# EAGLE schematic TINRS - Wobbler (pico)sch (EAGLE 7.7.0)

## Sheet 1 of 5: MCU & Eeprom
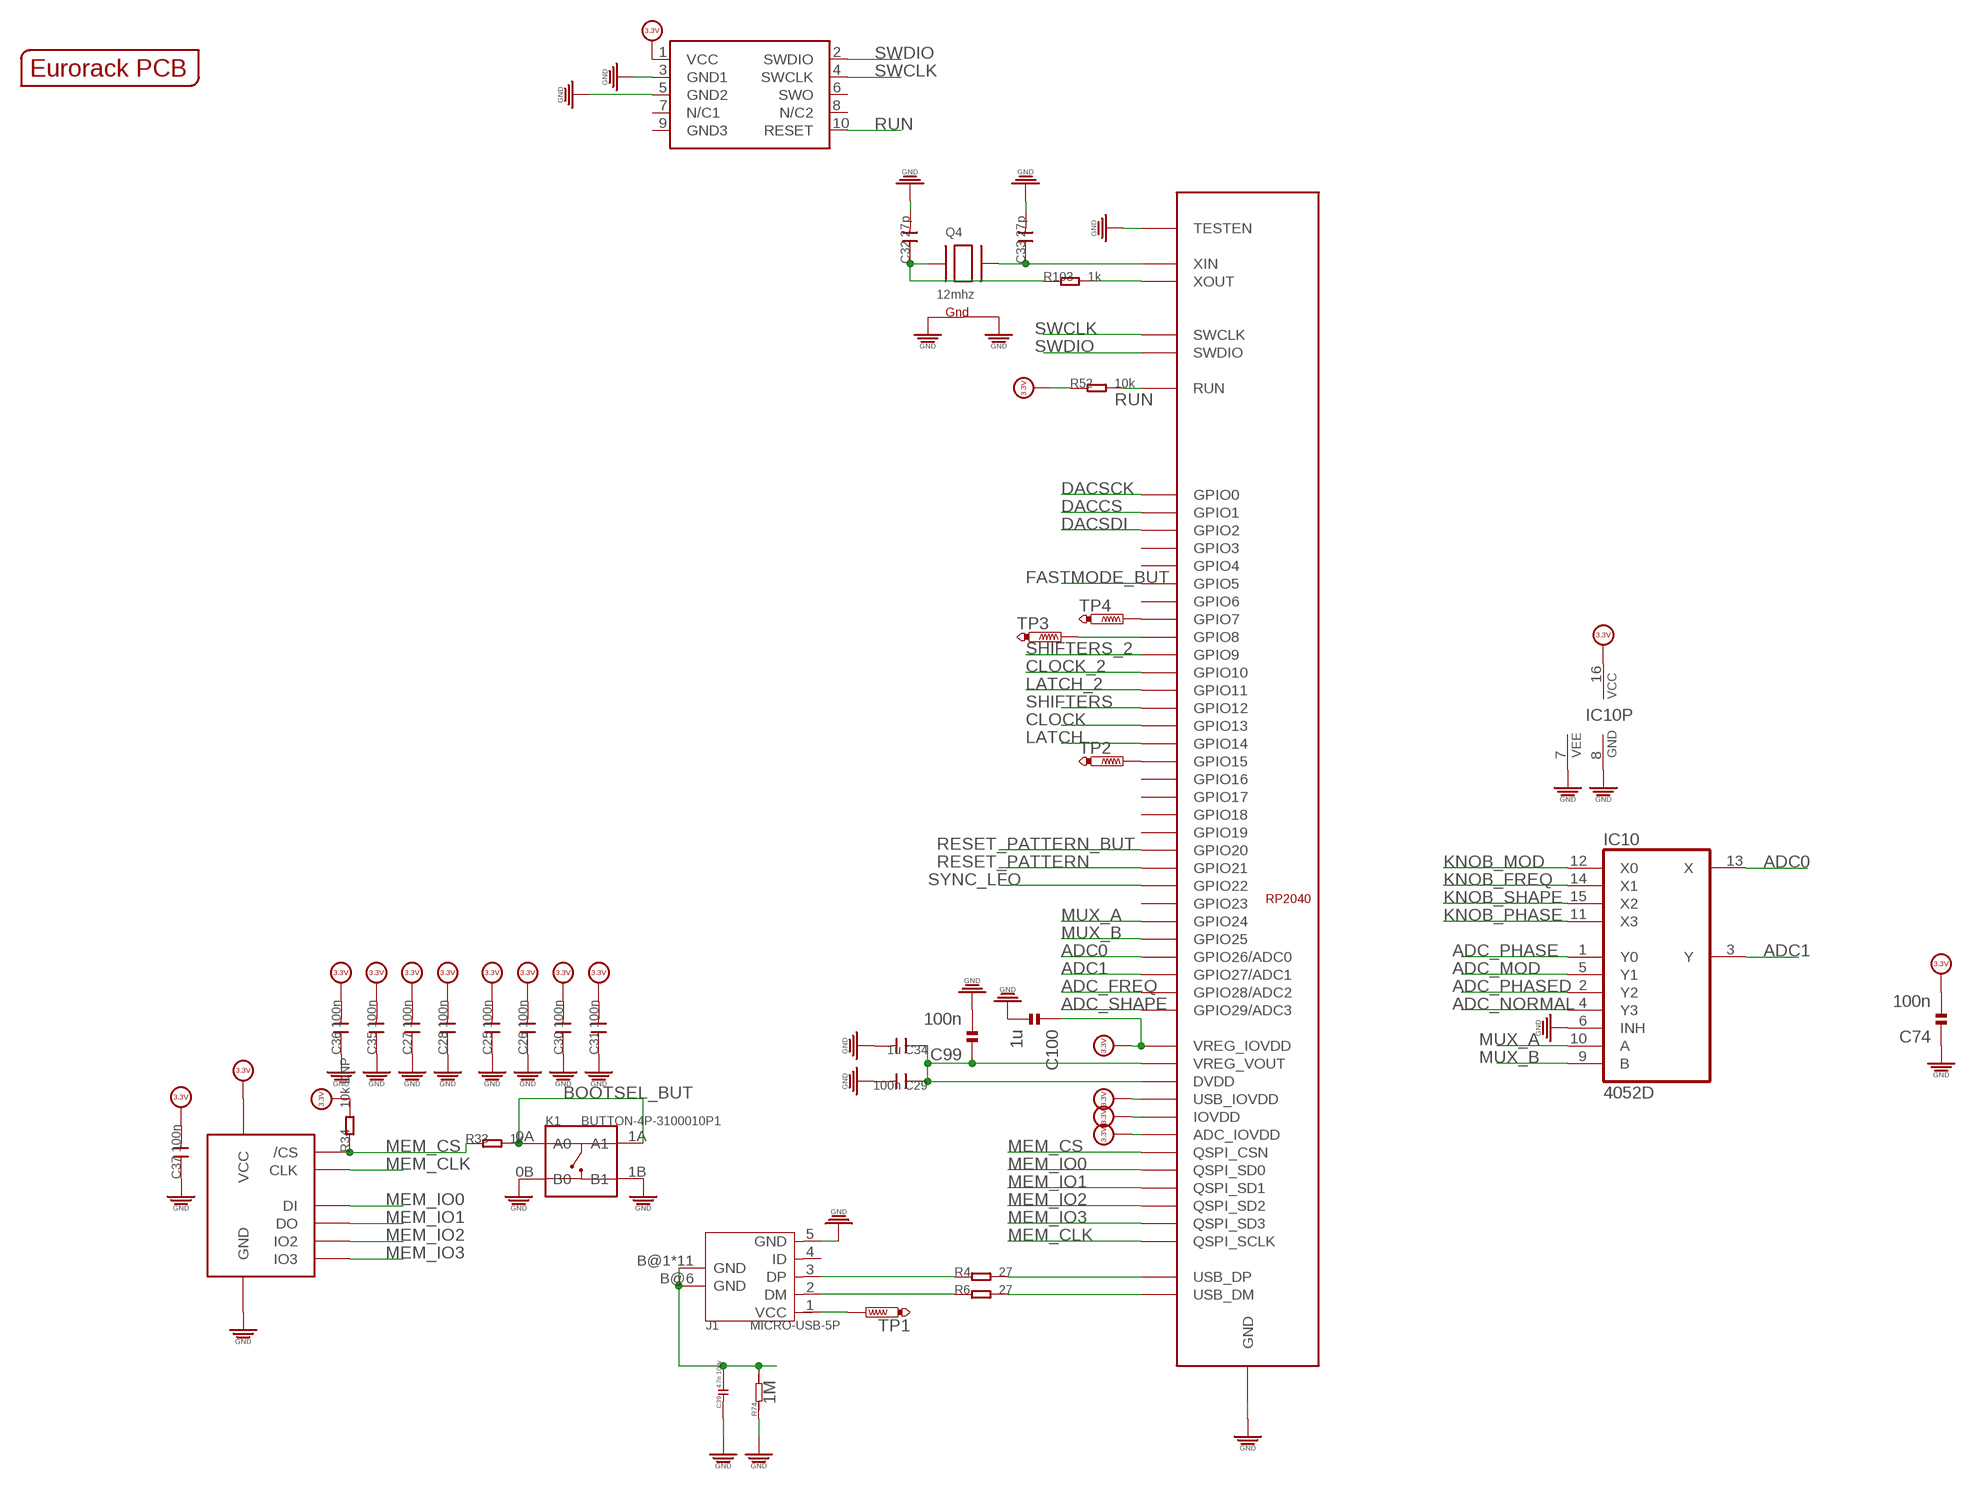
[diagram p0: schematic, sheet 1]

### Parts
C25  100n  C-0402  [C0402]
C26  100n  C-0402  [C0402]
C27  100n  C-0402  [C0402]
C28  100n  C-0402  [C0402]
C29  100n  C-0402  [C0402]
C30  100n  C-0402  [C0402]
C31  100n  C-0402  [C0402]
C32  27p  C-0402  [C0402]
C33  27p  C-0402  [C0402]
C34  1u  C-0402  [C0402]
C35  100n  C-0402  [C0402]
C36  100n  C-0402  [C0402]
C37  100n  C-0402  [C0402]
C39  4.7n 100v  C-1206  [C3216]
C74  100n  C-EUC0402  [C0402]
C99  100n  C-EUC0402  [C0402]
C100  1u  C-EUC0402  [C0402]
IC10  4052D  [SO16]
J1  MICRO-USB-5P  [C132563]
K1  BUTTON-4P-3100010P1  [4P-SMD-6.0X6.0X5.0H]
OUTLINE  EURORACK_PCB12HP  [EURORACK12HPPCB]
Q4  12mhz  XTAL-4-3225  [NX3225]
R4  27  R-0402  [R0402]
R6  27  R-0402  [R0402]
R33  1k  R-0402  [R0402]
R34  10k DNP  R-0402  [R0402]
R52  10k  R-0402  [R0402]
R74  1M  R-0603  [R0603]
R103  1k  R-0402  [R0402]
SWD2  CORTEX_SWD  [M50-3600542]
TP1  PTR1B1,27  [B1,27]
TP2  PTR1B1,27  [B1,27]
TP3  PTR1B1,27  [B1,27]
TP4  PTR1B1,27  [B1,27]
U$2  RP2040  [QFN-56]
U$25  W25Q256JVEIQTR  W25Q128JVSIQ  [SOIC-8]

### Nets
1.1V: C29.1 C34.1 C99.1 U$2.P$23(DVDD) U$2.P$45(VREG_VOUT) U$2.P$50(DVDD)
3.3V: C25.2 C26.2 C27.2 C28.2 C30.2 C31.2 C35.2 C36.2 C37.2 C74.2 C100.1 IC10.16(VCC) R34.2 R52.1 SWD2.1(VCC) U$2.P$1(IOVDD) U$2.P$10(IOVDD) U$2.P$22(IOVDD) U$2.P$33(IOVDD) U$2.P$42(IOVDD) U$2.P$43(ADC_IOVDD) U$2.P$44(VREG_IOVDD) U$2.P$48(USB_IOVDD) U$2.P$49(IOVDD) U$25.8(VCC) ; also sheet 2,3,4,5
ADC0: IC10.13(X) U$2.P$38(GPIO26/ADC0)
ADC1: IC10.3(Y) U$2.P$39(GPIO27/ADC1)
ADC_FREQ: U$2.P$40(GPIO28/ADC2) ; also sheet 5
ADC_MOD: IC10.5(Y1) ; also sheet 5
ADC_NORMAL: IC10.4(Y3) ; also sheet 5
ADC_PHASE: IC10.1(Y0) ; also sheet 5
ADC_PHASED: IC10.2(Y2) ; also sheet 5
ADC_SHAPE: U$2.P$41(GPIO29/ADC3) ; also sheet 5
BOOTSEL_BUT: K1.0A(A0) K1.1A(A1) R33.2
CLOCK: U$2.P$16(GPIO13) ; also sheet 2
CLOCK_2: U$2.P$13(GPIO10) ; also sheet 2
DACCS: U$2.P$3(GPIO1) ; also sheet 3
DACSCK: U$2.P$2(GPIO0) ; also sheet 3
DACSDI: U$2.P$4(GPIO2) ; also sheet 3
FASTMODE_BUT: U$2.P$7(GPIO5) ; also sheet 2
GND: C25.1 C26.1 C27.1 C28.1 C29.2 C30.1 C31.1 C32.2 C33.2 C34.2 C35.1 C36.1 C37.1 C39.P$1 C74.1 C99.2 C100.2 IC10.6(INH) IC10.7(VEE) IC10.8(GND) J1.5(GND) K1.0B(B0) K1.1B(B1) Q4.2(G2) Q4.4(G1) R74.1 SWD2.3(GND1) SWD2.5(GND2) U$2.GND U$2.P$19(TESTEN) U$25.4(GND) ; also sheet 2,3,4,5
KNOB_FREQ: IC10.14(X1) ; also sheet 5
KNOB_MOD: IC10.12(X0) ; also sheet 5
KNOB_PHASE: IC10.11(X3) ; also sheet 5
KNOB_SHAPE: IC10.15(X2) ; also sheet 5
LATCH: U$2.P$17(GPIO14) ; also sheet 2
LATCH_2: U$2.P$14(GPIO11) ; also sheet 2
MEM_CLK: U$2.P$52(QSPI_SCLK) U$25.6(CLK)
MEM_CS: R33.1 R34.1 U$2.P$56(QSPI_CSN) U$25.1(/CS)
MEM_IO0: U$2.P$53(QSPI_SD0) U$25.5(DI)
MEM_IO1: U$2.P$55(QSPI_SD1) U$25.2(DO)
MEM_IO2: U$2.P$54(QSPI_SD2) U$25.3(IO2)
MEM_IO3: U$2.P$51(QSPI_SD3) U$25.7(IO3)
MUX_A: IC10.10(A) U$2.P$36(GPIO24)
MUX_B: IC10.9(B) U$2.P$37(GPIO25)
N$2: C33.1 Q4.3(X2) U$2.P$20(XIN)
N$17: C32.1 Q4.1(X1) R103.1
N$18: R4.2 U$2.P$47(USB_DP)
N$24: R6.2 U$2.P$46(USB_DM)
N$69: C39.P$2 J1.B@1(GND) J1.B@2(GND) J1.B@3(GND) J1.B@4(GND) J1.B@5(GND) J1.B@6(GND) J1.B@7(GND) J1.B@8(GND) J1.B@9(GND) J1.B@10(GND) J1.B@11(GND) J1.B@12(GND) R74.2
N$81: J1.1(VCC) TP1.TP
N$82: TP2.TP U$2.P$18(GPIO15)
N$86: TP4.TP U$2.P$9(GPIO7)
N$87: R103.2 U$2.P$21(XOUT)
N$100: TP3.TP U$2.P$11(GPIO8)
RESET_PATTERN: U$2.P$32(GPIO21) ; also sheet 5
RESET_PATTERN_BUT: U$2.P$31(GPIO20) ; also sheet 2
RUN: R52.2 SWD2.10(RESET) U$2.P$26(RUN)
SHIFTERS: U$2.P$15(GPIO12) ; also sheet 2
SHIFTERS_2: U$2.P$12(GPIO9) ; also sheet 2
SWCLK: SWD2.4(SWCLK) U$2.P$24(SWCLK)
SWDIO: SWD2.2(SWDIO) U$2.P$25(SWDIO)
SYNC_LFO: U$2.P$34(GPIO22) ; also sheet 5
USB_N [groundplane]: J1.2(DM) R6.1
USB_P [groundplane]: J1.3(DP) R4.1
Unconnected: J1.4(ID) SWD2.6(SWO) SWD2.7(N/C1) SWD2.8(N/C2) SWD2.9(GND3) U$2.P$5(GPIO3) U$2.P$6(GPIO4) U$2.P$8(GPIO6) U$2.P$27(GPIO16) U$2.P$28(GPIO17) U$2.P$29(GPIO18) U$2.P$30(GPIO19) U$2.P$35(GPIO23)

## Sheet 2 of 5: LEDs & button
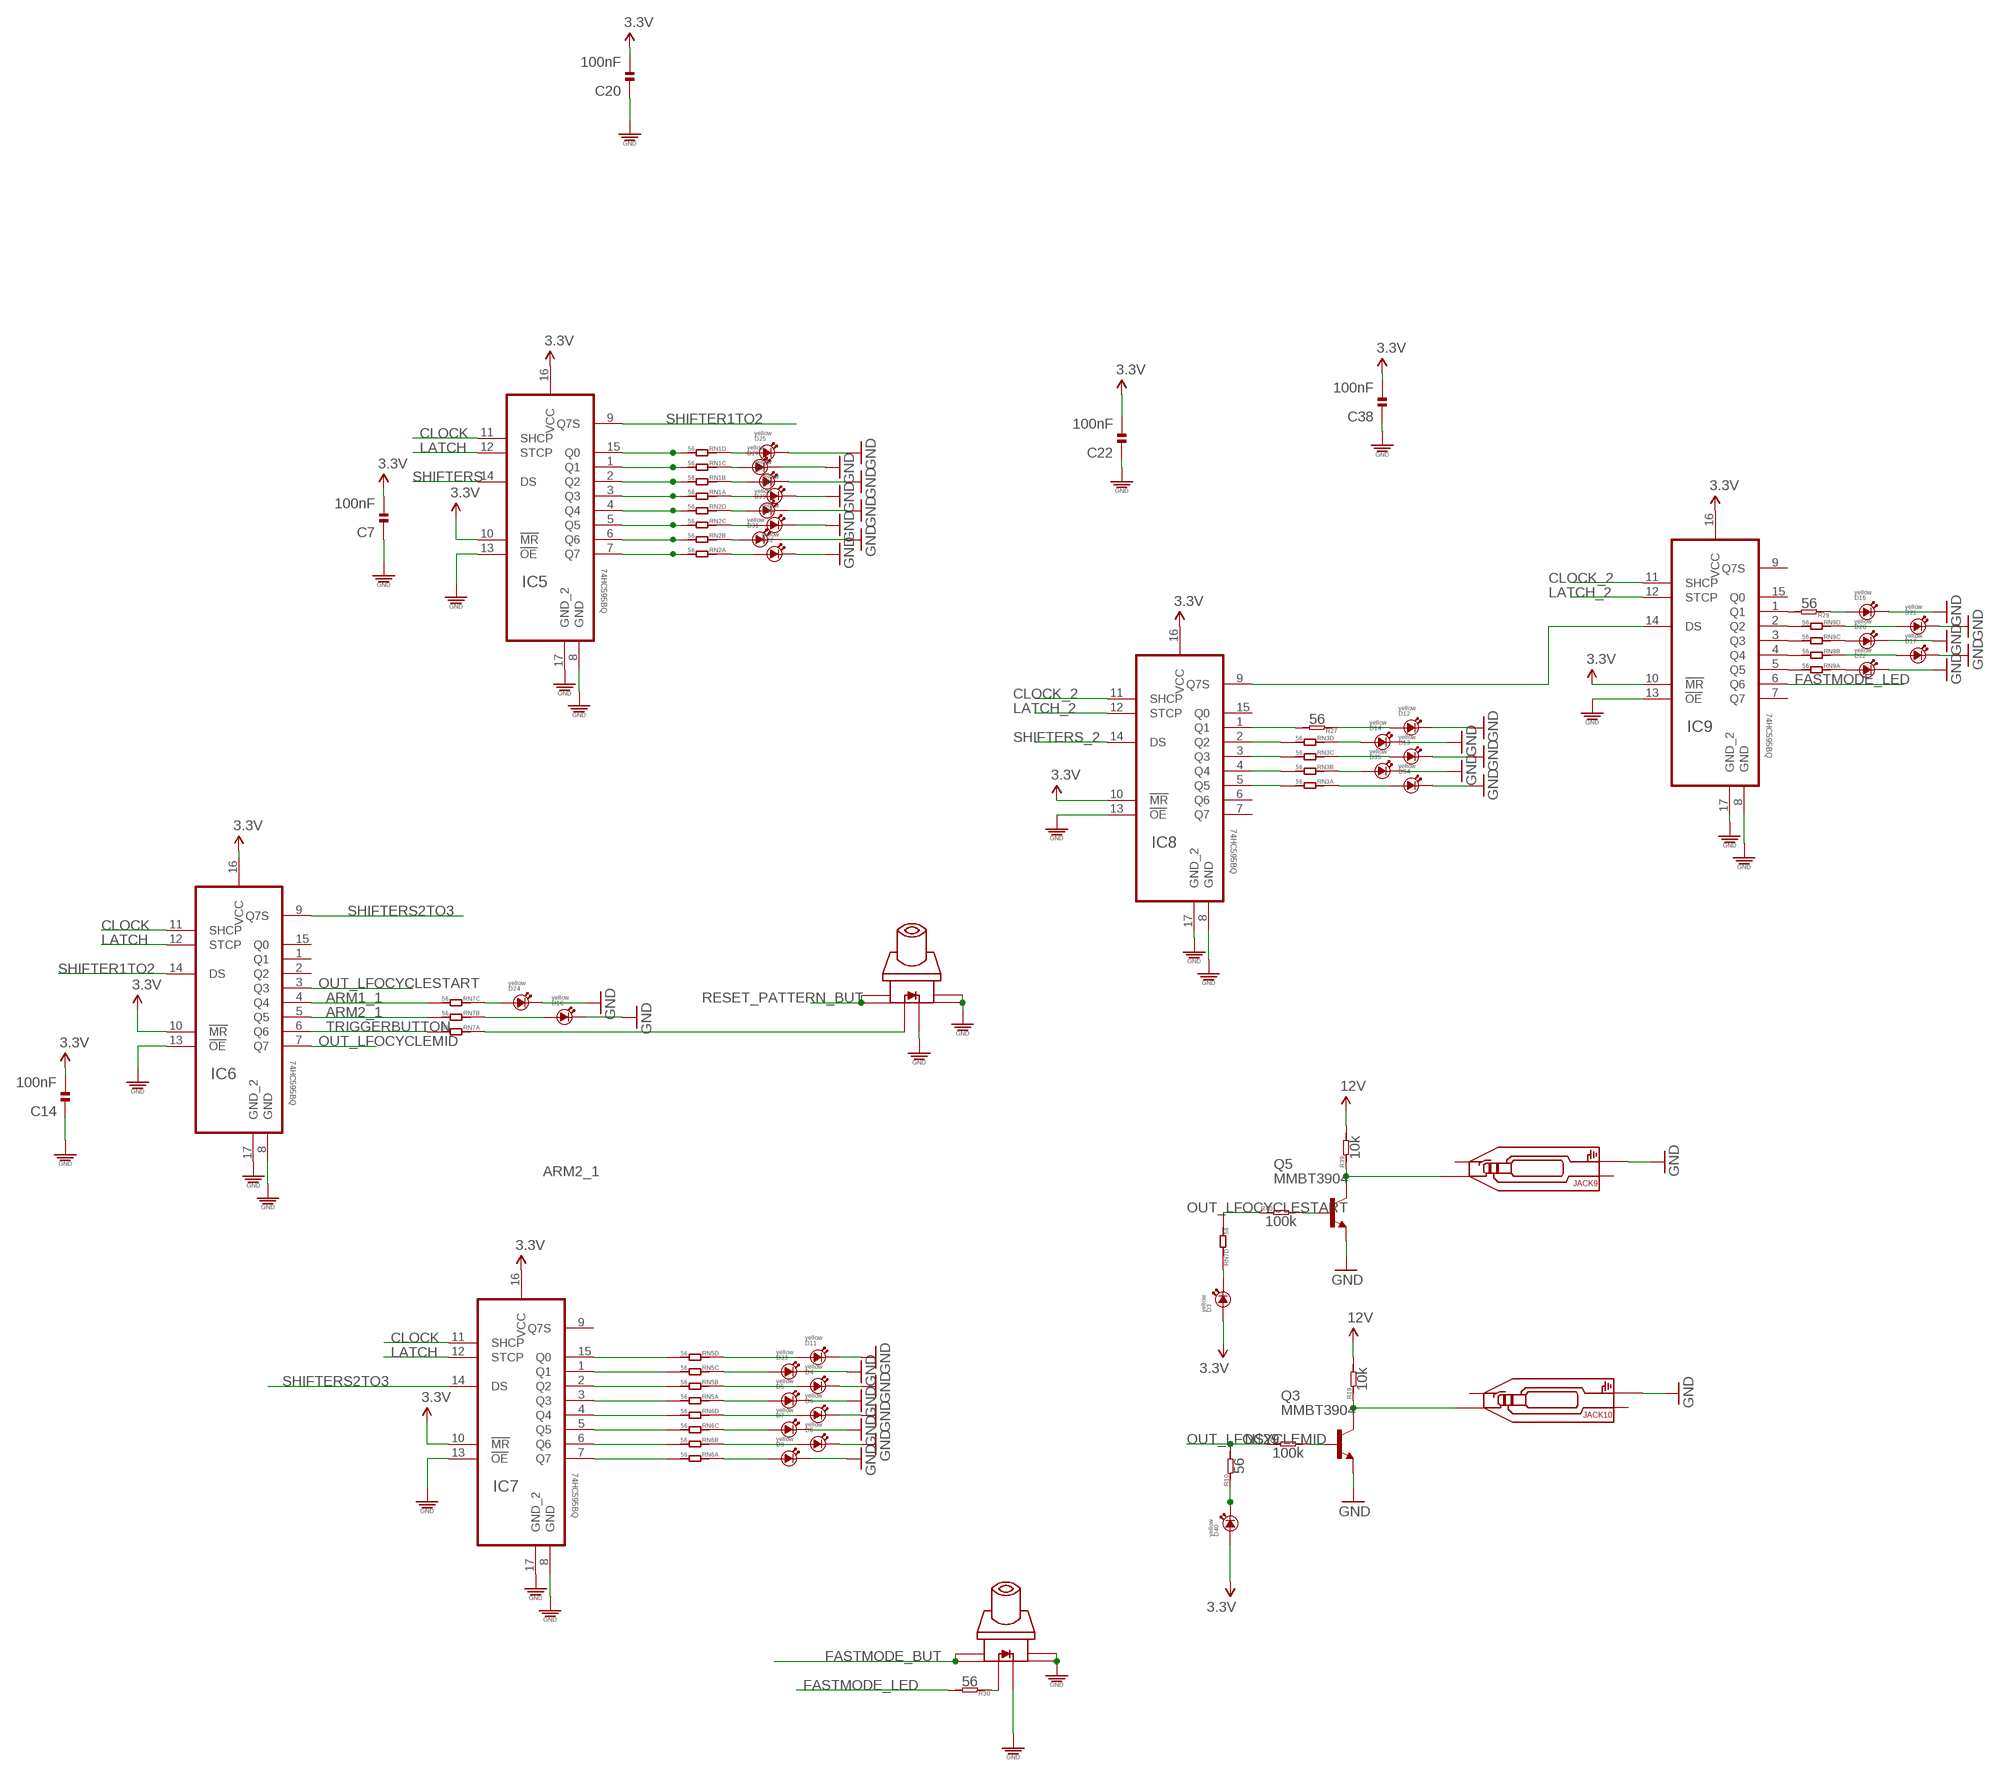
[diagram p1: schematic, sheet 2]

### Parts
C7  100nF  C-EUC0402  [C0402]
C14  100nF  C-EUC0402  [C0402]
C20  100nF  C-EUC0402  [C0402]
C22  100nF  C-EUC0402  [C0402]
C38  100nF  C-EUC0402  [C0402]
D3  yellow  LED3MM  [3MMLED]
D4  yellow  LED3MM  [3MMLED]
D5  yellow  LED3MM  [3MMLED]
D6  yellow  LED3MM  [3MMLED]
D7  yellow  LED3MM  [3MMLED]
D8  yellow  LED3MM  [3MMLED]
D9  yellow  LED3MM  [3MMLED]
D10  yellow  LED3MM  [3MMLED]
D11  yellow  LED3MM  [3MMLED]
D12  yellow  LED3MM  [3MMLED]
D13  yellow  LED3MM  [3MMLED]
D14  yellow  LED3MM  [3MMLED]
D16  yellow  LED3MM  [3MMLED]
D17  yellow  LED3MM  [3MMLED]
D20  yellow  LED3MM  [3MMLED]
D21  yellow  LED3MM  [3MMLED]
D22  yellow  LED3MM  [3MMLED]
D24  yellow  LED3MM  [3MMLED]
D25  yellow  LED3MM  [3MMLED]
D26  yellow  LED3MM  [3MMLED]
D27  yellow  LED3MM  [3MMLED]
D28  yellow  LED3MM  [3MMLED]
D29  yellow  LED3MM  [3MMLED]
D30  yellow  LED3MM  [3MMLED]
D31  yellow  LED3MM  [3MMLED]
D32  yellow  LED3MM  [3MMLED]
D33  yellow  LED3MM  [3MMLED]
D34  yellow  LED3MM  [3MMLED]
D35  yellow  LED3MM  [3MMLED]
D40  yellow  LED3MM  [3MMLED]
IC5  74HC595BQ  [QFN50P250X350X100-17N]
IC6  74HC595BQ  [QFN50P250X350X100-17N]
IC7  74HC595BQ  [QFN50P250X350X100-17N]
IC8  74HC595BQ  [QFN50P250X350X100-17N]
IC9  74HC595BQ  [QFN50P250X350X100-17N]
JACK9  AUDIO-JACK_SMALLSYMBOL  [3.5MM-JACK-SWITCH-13MM-NOHOLES-TESTPAD]
JACK10  AUDIO-JACK_SMALLSYMBOL  [3.5MM-JACK-SWITCH-13MM-NOHOLES-TESTPAD]
Q3  MMBT3904  MMBT3904LT1-NPN-SOT23-BEC  [SOT23-BEC]
Q5  MMBT3904  MMBT3904LT1-NPN-SOT23-BEC  [SOT23-BEC]
R10  56  R-0603  [R0603]
R19  10k  R-0603  [R0603]
R21  100k  R-0603  [R0603]
R27  56  R-0603  [R0603]
R29  56  R-0603  [R0603]
R30  56  R-0603  [R0603]
R39  10k  R-0603  [R0603]
R40  100k  R-0603  [R0603]
RN1  56  4R-N0402ARV341  [4X0402ARV341]
RN2  56  4R-N0402ARV341  [4X0402ARV341]
RN3  56  4R-N0402ARV341  [4X0402ARV341]
RN5  56  4R-N0402ARV341  [4X0402ARV341]
RN6  56  4R-N0402ARV341  [4X0402ARV341]
RN7  56  4R-N0402ARV341  [4X0402ARV341]
RN9  56  4R-N0402ARV341  [4X0402ARV341]
U$1  SWITCH_W_LED_PB6149L-X-102YELLOW  [PB6149L]
U$28  SWITCH_W_LED_PB6149L-X-102YELLOW  [PB6149L]

### Nets
3.3V: C7.2 C14.2 C20.2 C22.2 C38.2 D3.+ D40.+ IC5.10(!MR) IC5.16(VCC) IC6.10(!MR) IC6.16(VCC) IC7.10(!MR) IC7.16(VCC) IC8.10(!MR) IC8.16(VCC) IC9.10(!MR) IC9.16(VCC) ; also sheet 1,3,4,5
12V [heavypower]: R19.2 R39.2 ; also sheet 3,4
ARM1_1: IC6.4(Q4) RN7.3
ARM2_1: IC6.5(Q5) RN7.2
CLOCK: IC5.11(SHCP) IC6.11(SHCP) IC7.11(SHCP) ; also sheet 1
CLOCK_2: IC8.11(SHCP) IC9.11(SHCP) ; also sheet 1
FASTMODE_BUT: U$28.1 U$28.2 ; also sheet 1
FASTMODE_LED: IC9.6(Q6) R30.2
GND: C7.1 C14.1 C20.1 C22.1 C38.1 D4.- D5.- D6.- D7.- D8.- D9.- D10.- D11.- D12.- D13.- D14.- D16.- D17.- D20.- D21.- D22.- D24.- D25.- D26.- D27.- D28.- D29.- D30.- D31.- D32.- D33.- D34.- D35.- IC5.8(GND) IC5.13(!OE) IC5.17(GND_2) IC6.8(GND) IC6.13(!OE) IC6.17(GND_2) IC7.8(GND) IC7.13(!OE) IC7.17(GND_2) IC8.8(GND) IC8.13(!OE) IC8.17(GND_2) IC9.8(GND) IC9.13(!OE) IC9.17(GND_2) JACK9.RING_B@1(RING) JACK9.RING_T@3(RING) JACK10.RING_B@1(RING) JACK10.RING_T@3(RING) Q3.E Q5.E U$1.3 U$1.4 U$1.LEDNEG(NEG) U$28.3 U$28.4 U$28.LEDNEG(NEG) ; also sheet 1,3,4,5
LATCH: IC5.12(STCP) IC6.12(STCP) IC7.12(STCP) ; also sheet 1
LATCH_2: IC8.12(STCP) IC9.12(STCP) ; also sheet 1
N$1: IC5.15(Q0) RN1.4
N$14: D7.+ RN6.6
N$19: IC5.1(Q1) RN1.3
N$22: IC5.2(Q2) RN1.2
N$23: D40.- R10.1
N$25: Q3.B R21.2
N$26: IC5.3(Q3) RN1.1
N$27: D3.- RN7.5
N$28: D29.+ RN2.5
N$29: JACK10.TIP_B@1(TIP) JACK10.TIP_T@3(TIP) Q3.C R19.1
N$30: IC5.4(Q4) RN2.4
N$31: IC5.5(Q5) RN2.3
N$32: D28.+ RN1.8
N$35: IC5.6(Q6) RN2.2
N$36: IC5.7(Q7) RN2.1
N$37: IC8.2(Q2) RN3.4
N$38: IC7.7(Q7) RN6.1
N$39: IC7.6(Q6) RN6.2
N$40: IC7.5(Q5) RN6.3
N$41: D10.+ RN7.7
N$42: D13.+ RN3.6
N$43: IC7.4(Q4) RN6.4
N$46: D6.+ RN6.5
N$47: D5.+ RN5.8
N$48: D4.+ RN5.7
N$49: D8.+ RN6.7
N$50: D9.+ RN6.8
N$51: RN7.8 U$1.LEDPOS(POS)
N$52: D11.+ RN5.5
N$53: IC7.3(Q3) RN5.1
N$54: IC7.2(Q2) RN5.2
N$55: IC7.1(Q1) RN5.3
N$56: IC7.15(Q0) RN5.4
N$57: IC8.3(Q3) RN3.3
N$58: D14.+ RN3.5
N$59: IC8.4(Q4) RN3.2
N$60: Q5.B R40.2
N$61: JACK9.TIP_B@1(TIP) JACK9.TIP_T@3(TIP) Q5.C R39.1
N$62: IC8.5(Q5) RN3.1
N$63: IC8.1(Q1) R27.2
N$65: D12.+ R27.1
N$66: D34.+ RN3.8
N$67: D35.+ RN3.7
N$68: IC9.5(Q5) RN9.1
N$71: R30.1 U$28.LEDPOS(POS)
N$72: D20.+ RN9.6
N$73: D30.+ RN2.6
N$74: D31.+ RN2.7
N$75: D32.+ RN2.8
N$76: D24.+ RN7.6
N$77: D27.+ RN1.7
N$78: D26.+ RN1.6
N$79: D25.+ RN1.5
N$80: D33.+ RN5.6
N$83: D16.+ R29.1
N$84: D21.+ RN9.5
N$85: D17.+ RN9.7
N$88: D22.+ RN9.8
N$89: IC9.4(Q4) RN9.2
N$90: IC9.3(Q3) RN9.3
N$91: IC9.2(Q2) RN9.4
N$92: IC9.1(Q1) R29.2
N$94: IC8.9(Q7S) IC9.14(DS)
OUT_LFOCYCLEMID: IC6.7(Q7) R10.2 R21.1
OUT_LFOCYCLESTART: IC6.3(Q3) R40.1 RN7.4
RESET_PATTERN_BUT: U$1.1 U$1.2 ; also sheet 1
SHIFTER1TO2: IC5.9(Q7S) IC6.14(DS)
SHIFTERS: IC5.14(DS) ; also sheet 1
SHIFTERS2TO3: IC6.9(Q7S) IC7.14(DS)
SHIFTERS_2: IC8.14(DS) ; also sheet 1
TRIGGERBUTTON: IC6.6(Q6) RN7.1
Unconnected: IC6.1(Q1) IC6.2(Q2) IC6.15(Q0) IC7.9(Q7S) IC8.6(Q6) IC8.7(Q7) IC8.15(Q0) IC9.7(Q7) IC9.9(Q7S) IC9.15(Q0) JACK9.SECOND_B@1(SECOND) JACK9.SECOND_T@3(SECOND) JACK9.SWITCH_B@1(SWITCH) JACK9.SWITCH_T@3(SWITCH) JACK10.SECOND_B@1(SECOND) JACK10.SECOND_T@3(SECOND) JACK10.SWITCH_B@1(SWITCH) JACK10.SWITCH_T@3(SWITCH)

## Sheet 3 of 5: DAC & Trigger outs
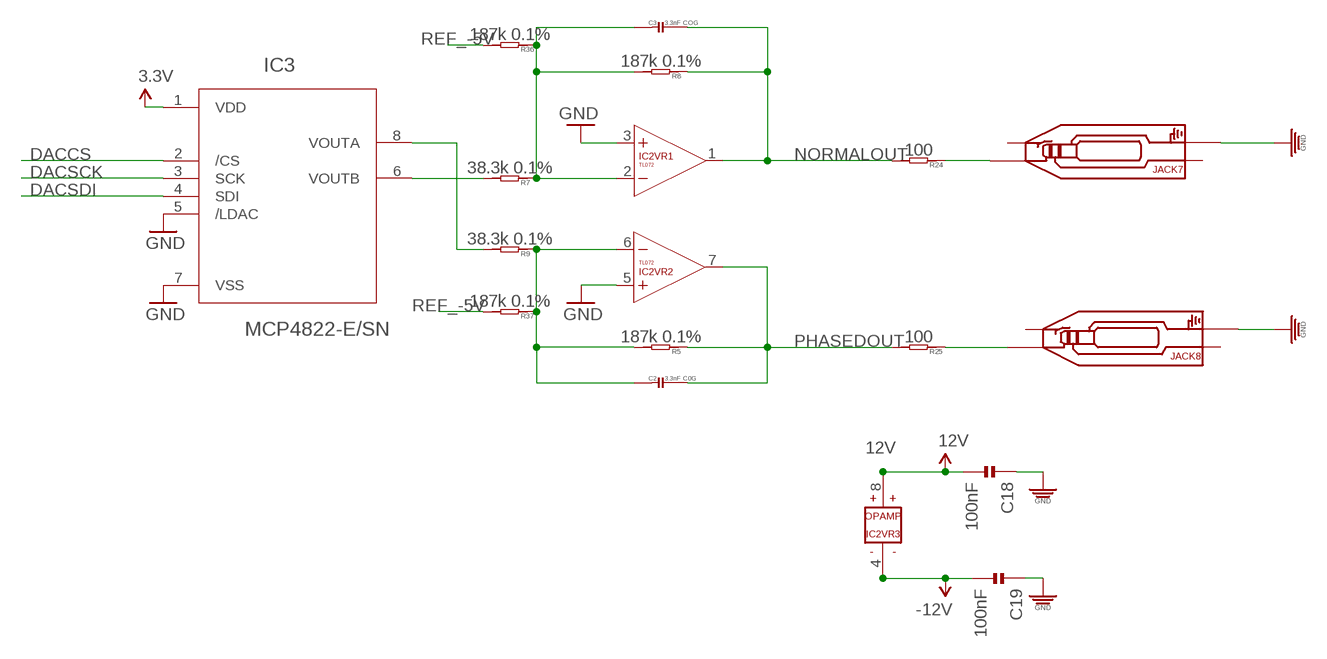
[diagram p2: schematic, sheet 3]

### Parts
C2  3.3nF C0G  C-0603  [C0603]
C3  3.3nF COG  C-0603  [C0603]
C18  100nF  C-EUC0402  [C0402]
C19  100nF  C-EUC0402  [C0402]
IC2  TL072  [SO08]
IC3  MCP4822-E/SN  [SOIC8-N_MC]
JACK7  AUDIO-JACK_SMALLSYMBOL  [3.5MM-JACK-SWITCH-13MM-NOHOLES-TESTPAD]
JACK8  AUDIO-JACK_SMALLSYMBOL  [3.5MM-JACK-SWITCH-13MM-NOHOLES-TESTPAD]
R5  187k 0.1%  R-0603  [R0603]
R7  38.3k 0.1%  R-0603  [R0603]
R8  187k 0.1%  R-0603  [R0603]
R9  38.3k 0.1%  R-0603  [R0603]
R24  100  R-0603  [R0603]
R25  100  R-0603  [R0603]
R36  187k 0.1%  R-0603  [R0603]
R37  187k 0.1%  R-0603  [R0603]

### Nets
3.3V: IC3.1(VDD) ; also sheet 1,2,4,5
12V [heavypower]: C18.2 IC2.8(VR3:V+) ; also sheet 2,4
-12V [heavypower]: C19.2 IC2.4(VR3:V-) ; also sheet 4
DACCS: IC3.2(/CS) ; also sheet 1
DACSCK: IC3.3(SCK) ; also sheet 1
DACSDI: IC3.4(SDI) ; also sheet 1
GND: C18.1 C19.1 IC2.3(VR1:+IN) IC2.5(VR2:+IN) IC3.5(/LDAC) IC3.7(VSS) JACK7.RING_B@1(RING) JACK7.RING_T@3(RING) JACK8.RING_B@1(RING) JACK8.RING_T@3(RING) ; also sheet 1,2,4,5
N$5: IC3.8(VOUTA) R9.2
N$7: IC3.6(VOUTB) R7.2
N$9: C2.1 IC2.6(VR2:-IN) R5.2 R9.1 R37.1
N$10: C3.1 IC2.2(VR1:-IN) R7.1 R8.2 R36.1
N$20: JACK8.TIP_B@1(TIP) JACK8.TIP_T@3(TIP) R25.1
N$21: JACK7.TIP_B@1(TIP) JACK7.TIP_T@3(TIP) R24.1
NORMALOUT: C3.2 IC2.1(VR1:OUT) R8.1 R24.2
PHASEDOUT: C2.2 IC2.7(VR2:OUT) R5.1 R25.2
REF_-5V [heavypower]: R36.2 R37.2 ; also sheet 4,5
Unconnected: JACK7.SECOND_B@1(SECOND) JACK7.SECOND_T@3(SECOND) JACK7.SWITCH_B@1(SWITCH) JACK7.SWITCH_T@3(SWITCH) JACK8.SECOND_B@1(SECOND) JACK8.SECOND_T@3(SECOND) JACK8.SWITCH_B@1(SWITCH) JACK8.SWITCH_T@3(SWITCH)

## Sheet 4 of 5: Power
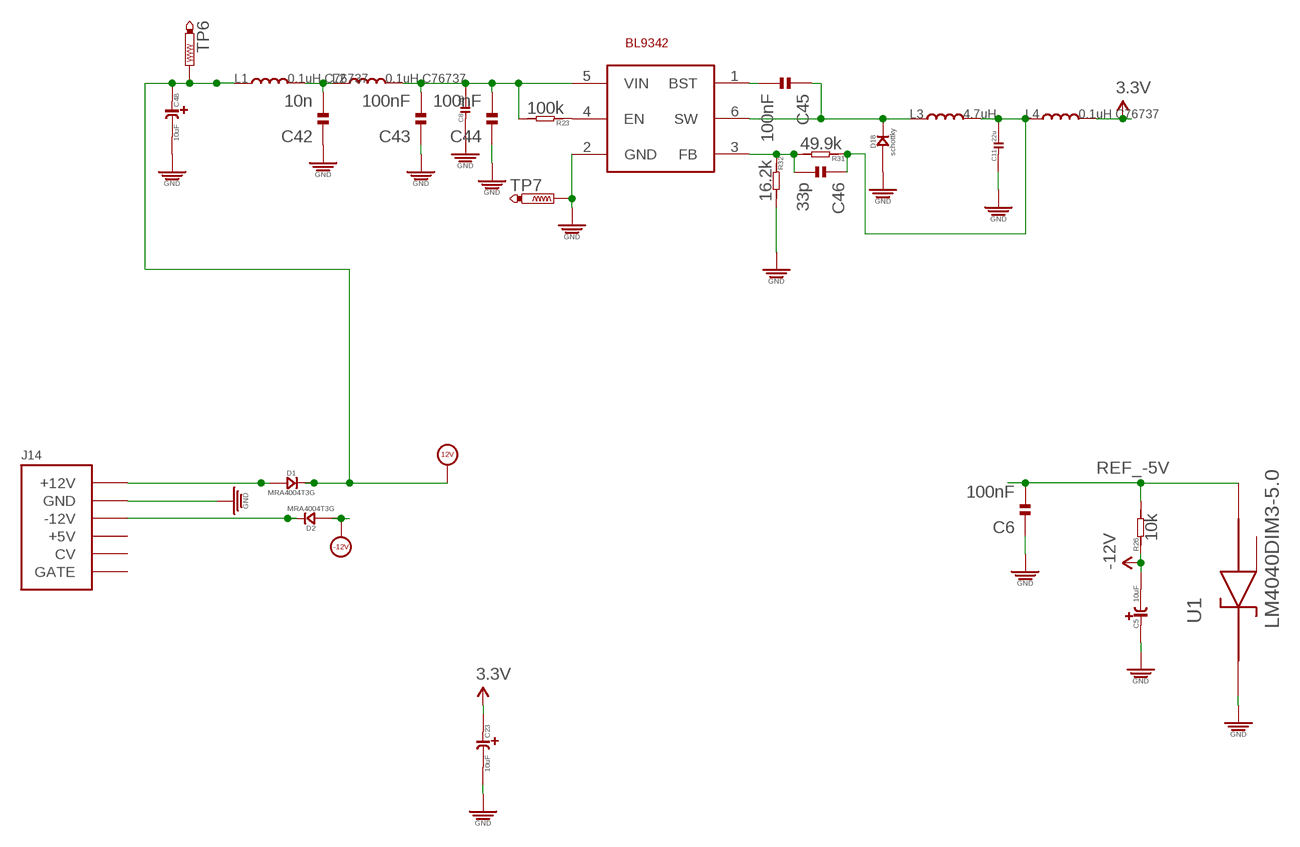
[diagram p3: schematic, sheet 4]

### Parts
C5  10uF  C-POLAR-A  [CASE-A_3216]
C6  100nF  C-EUC0402  [C0402]
C8  10u  C-0805  [C0805]
C11  22u  C-0805  [C0805]
C23  10uF  C-POLAR-A  [CASE-A_3216]
C42  10n  C-EUC0402  [C0402]
C43  100nF  C-EUC0402  [C0402]
C44  100nF  C-EUC0402  [C0402]
C45  100nF  C-EUC0402  [C0402]
C46  33p  C-EUC0402  [C0402]
C48  10uF  C-POLAR-A  [CASE-A_3216]
D1  MRA4004T3G  D-SMA  [DO-214AC]
D2  MRA4004T3G  D-SMA  [DO-214AC]
D18  schottky  D-SOD-123  [SOD123]
J14  POWERSHROUDED  [POWER_16_SHROUDED]
L1  0.1uH C76737  L-0805  [L0805]
L2  0.1uH C76737  L-0805  [L0805]
L3  4.7uH  L-SPD3D16-4R7M  [L0420]
L4  0.1uH C76737  L-0805  [L0805]
R23  100k  R-0603  [R0603]
R26  10k  R-0603  [R0603]
R31  49.9k  R-0603  [R0603]
R32  16.2k  R-0603  [R0603]
TP6  PTR1B1,27  [B1,27]
TP7  PTR1B1,27  [B1,27]
U1  LM4040DIM3-5.0  [SOT95P237X112-3N]
U$5  BL9342  [SOT23-6]

### Nets
3.3V: C23.+ L4.2 ; also sheet 1,2,3,5
12V [heavypower]: C48.+ D1.2(-) L1.1 TP6.TP ; also sheet 2,3
-12V [heavypower]: C5.- D2.1(+) R26.1 ; also sheet 3
GND: C5.+ C6.1 C8.1 C11.1 C23.- C42.1 C43.1 C44.1 C48.- D18.+ J14.3(GND) J14.4(GND) J14.5(GND) J14.6(GND) J14.7(GND) J14.8(GND) R32.2 TP7.TP U1.1(CATHODE) U$5.2(GND) ; also sheet 1,2,3,5
N$13 [reallyheav]: D1.1(+) J14.9(+12V) J14.10(+12V)
N$64 [reallyheav]: D2.2(-) J14.1(-12V) J14.2(-12V)
N$70 [heavypower]: C42.2 L1.2 L2.1
N$93 [heavypower]: C8.2 C43.2 C44.2 L2.2 R23.2 U$5.5(VIN)
N$95: C45.2 U$5.1(BST)
N$96 [heavypower]: C45.1 D18.- L3.1 U$5.6(SW)
N$97: C46.2 R31.2 R32.1 U$5.3(FB)
N$98: C11.2 C46.1 L3.2 L4.1 R31.1
N$99 [heavypower]: R23.1 U$5.4(EN)
REF_-5V [heavypower]: C6.2 R26.2 U1.2(ANODE) ; also sheet 3,5
Unconnected: J14.11(+5V) J14.12(+5V) J14.13(CV) J14.14(CV) J14.15(GATE) J14.16(GATE) U1.3(NC)

## Sheet 5 of 5: Inputs & Knobs
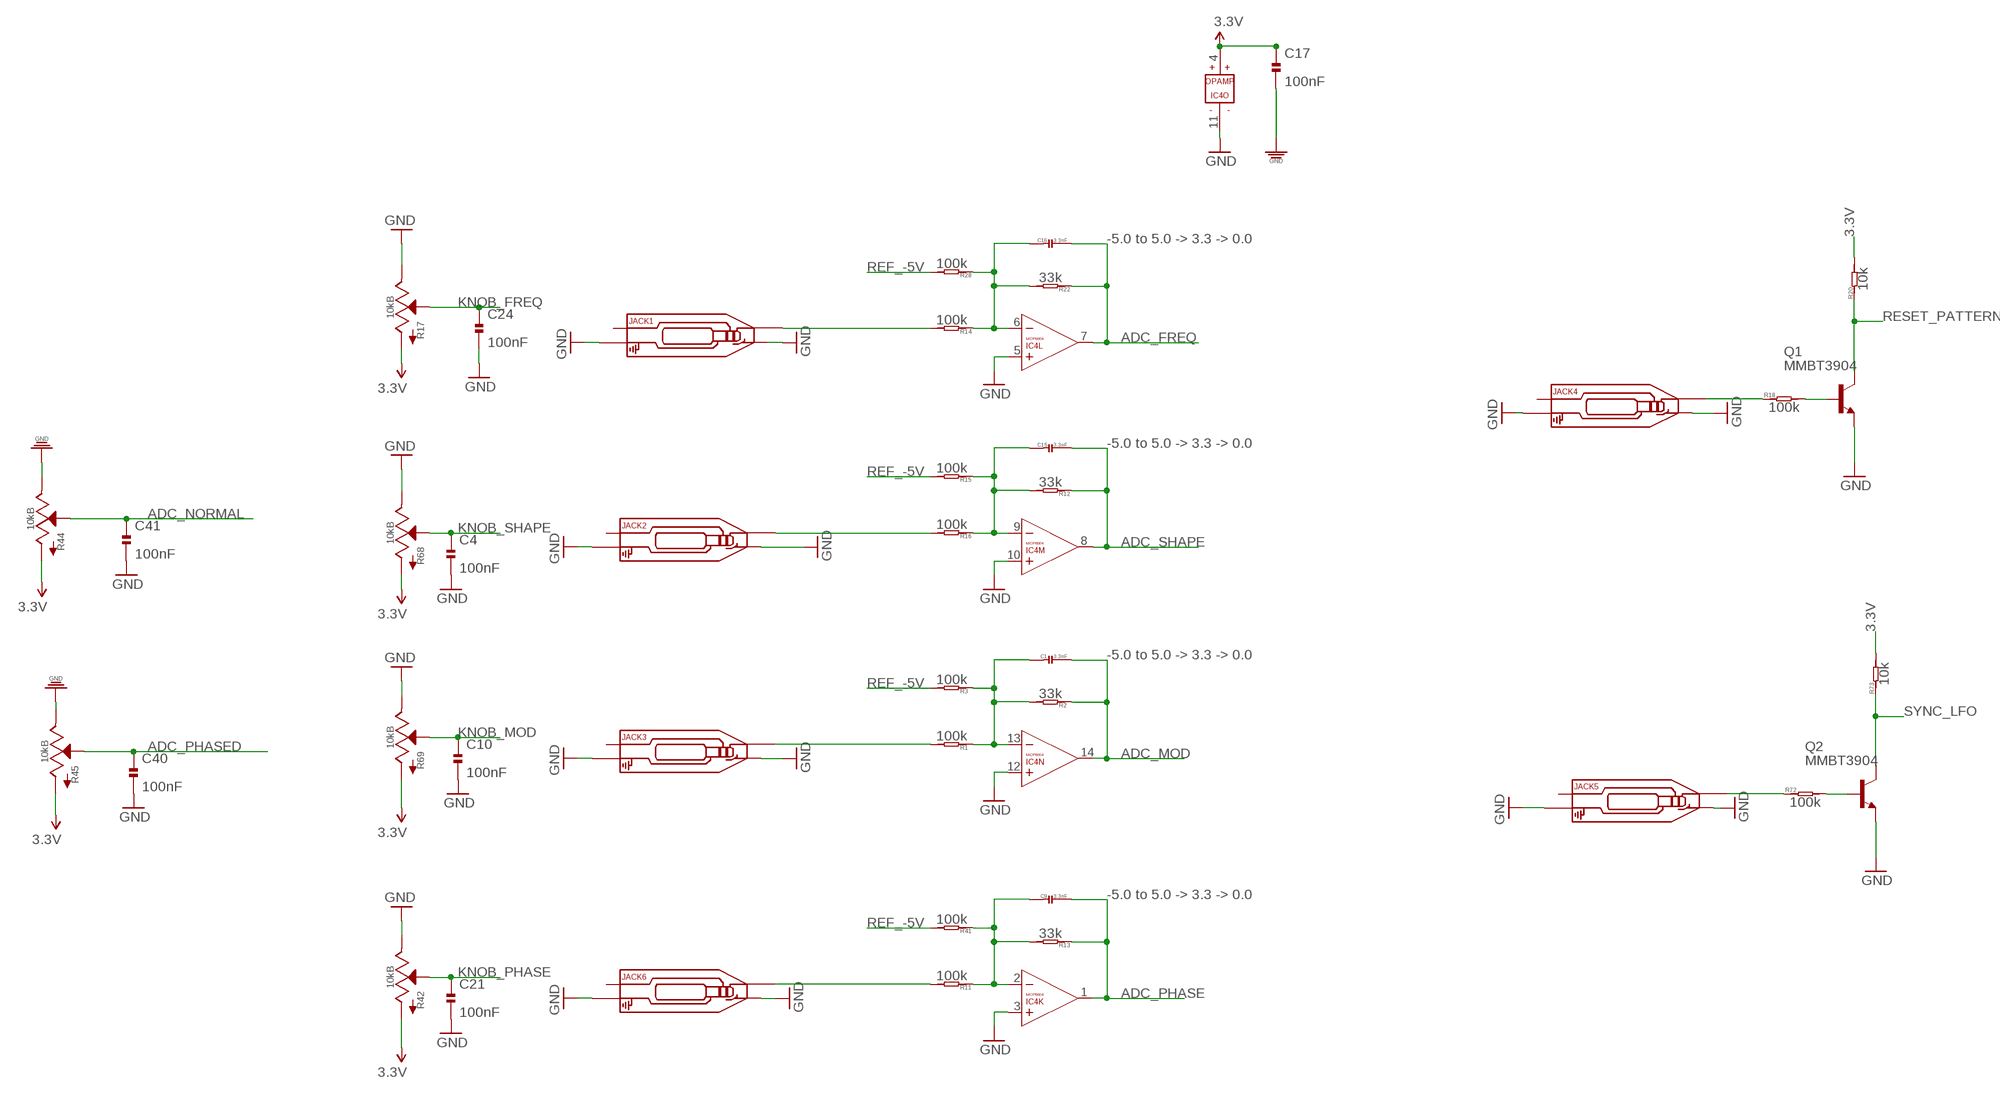
[diagram p4: schematic, sheet 5]

### Parts
C1  3.3nF  C-0603  [C0603]
C4  100nF  C-EUC0402  [C0402]
C9  3.3nF  C-0603  [C0603]
C10  100nF  C-EUC0402  [C0402]
C15  3.3nF  C-0603  [C0603]
C16  3.3nF  C-0603  [C0603]
C17  100nF  C-EUC0402  [C0402]
C21  100nF  C-EUC0402  [C0402]
C24  100nF  C-EUC0402  [C0402]
C40  100nF  C-EUC0402  [C0402]
C41  100nF  C-EUC0402  [C0402]
IC4  MCP6004  [SO14]
JACK1  AUDIO-JACK_SMALLSYMBOL  [3.5MM-JACK-SWITCH-13MM-NOHOLES-TESTPAD]
JACK2  AUDIO-JACK_SMALLSYMBOL  [3.5MM-JACK-SWITCH-13MM-NOHOLES-TESTPAD]
JACK3  AUDIO-JACK_SMALLSYMBOL  [3.5MM-JACK-SWITCH-13MM-NOHOLES-TESTPAD]
JACK4  AUDIO-JACK_SMALLSYMBOL  [3.5MM-JACK-SWITCH-13MM-NOHOLES-TESTPAD]
JACK5  AUDIO-JACK_SMALLSYMBOL  [3.5MM-JACK-SWITCH-13MM-NOHOLES-TESTPAD]
JACK6  AUDIO-JACK_SMALLSYMBOL  [3.5MM-JACK-SWITCH-13MM-NOHOLES-TESTPAD]
Q1  MMBT3904  MMBT3904LT1-NPN-SOT23-BEC  [SOT23-BEC]
Q2  MMBT3904  MMBT3904LT1-NPN-SOT23-BEC  [SOT23-BEC]
R1  100k  R-0603  [R0603]
R2  33k  R-0603  [R0603]
R3  100k  R-0603  [R0603]
R11  100k  R-0603  [R0603]
R12  33k  R-0603  [R0603]
R13  33k  R-0603  [R0603]
R14  100k  R-0603  [R0603]
R15  100k  R-0603  [R0603]
R16  100k  R-0603  [R0603]
R17  10kB  POTSQUAREHOLE_SMALLKNOB  [ALPS_POT_SQUAREHOLES]
R18  100k  R-0603  [R0603]
R20  10k  R-0603  [R0603]
R22  33k  R-0603  [R0603]
R28  100k  R-0603  [R0603]
R41  100k  R-0603  [R0603]
R42  10kB  POTSQUAREHOLE_SMALLKNOB  [ALPS_POT_SQUAREHOLES]
R44  10kB  POTSQUAREHOLE_SMALLKNOB  [ALPS_POT_SQUAREHOLES]
R45  10kB  POTSQUAREHOLE_SMALLKNOB  [ALPS_POT_SQUAREHOLES]
R68  10kB  POTSQUAREHOLE_SMALLKNOB  [ALPS_POT_SQUAREHOLES]
R69  10kB  POTSQUAREHOLE_SMALLKNOB  [ALPS_POT_SQUAREHOLES]
R72  100k  R-0603  [R0603]
R73  10k  R-0603  [R0603]

### Nets
3.3V: C17.1 IC4.4(O:V+) R17.P$3(A) R20.2 R42.P$3(A) R44.P$3(A) R45.P$3(A) R68.P$3(A) R69.P$3(A) R73.2 ; also sheet 1,2,3,4
ADC_FREQ: C16.2 IC4.7(L:OUT) R22.1 ; also sheet 1
ADC_MOD: C1.2 IC4.14(N:OUT) R2.1 ; also sheet 1
ADC_NORMAL: C41.1 R44.P$2(S) ; also sheet 1
ADC_PHASE: C9.2 IC4.1(K:OUT) R13.1 ; also sheet 1
ADC_PHASED: C40.1 R45.P$2(S) ; also sheet 1
ADC_SHAPE: C15.2 IC4.8(M:OUT) R12.1 ; also sheet 1
GND: C4.2 C10.2 C17.2 C21.2 C24.2 C40.2 C41.2 IC4.3(K:+IN) IC4.5(L:+IN) IC4.10(M:+IN) IC4.11(O:V-) IC4.12(N:+IN) JACK1.RING_B@1(RING) JACK1.RING_T@3(RING) JACK1.SWITCH_B@1(SWITCH) JACK1.SWITCH_T@3(SWITCH) JACK2.RING_B@1(RING) JACK2.RING_T@3(RING) JACK2.SWITCH_B@1(SWITCH) JACK2.SWITCH_T@3(SWITCH) JACK3.RING_B@1(RING) JACK3.RING_T@3(RING) JACK3.SWITCH_B@1(SWITCH) JACK3.SWITCH_T@3(SWITCH) JACK4.RING_B@1(RING) JACK4.RING_T@3(RING) JACK4.SWITCH_B@1(SWITCH) JACK4.SWITCH_T@3(SWITCH) JACK5.RING_B@1(RING) JACK5.RING_T@3(RING) JACK5.SWITCH_B@1(SWITCH) JACK5.SWITCH_T@3(SWITCH) JACK6.RING_B@1(RING) JACK6.RING_T@3(RING) JACK6.SWITCH_B@1(SWITCH) JACK6.SWITCH_T@3(SWITCH) Q1.E Q2.E R17.P$1(E) R42.P$1(E) R44.P$1(E) R45.P$1(E) R68.P$1(E) R69.P$1(E) ; also sheet 1,2,3,4
KNOB_FREQ: C24.1 R17.P$2(S) ; also sheet 1
KNOB_MOD: C10.1 R69.P$2(S) ; also sheet 1
KNOB_PHASE: C21.1 R42.P$2(S) ; also sheet 1
KNOB_SHAPE: C4.1 R68.P$2(S) ; also sheet 1
N$3: JACK2.TIP_B@1(TIP) JACK2.TIP_T@3(TIP) R16.2
N$4: C15.1 IC4.9(M:-IN) R12.2 R15.1 R16.1
N$6: JACK3.TIP_B@1(TIP) JACK3.TIP_T@3(TIP) R1.2
N$8: C1.1 IC4.13(N:-IN) R1.1 R2.2 R3.1
N$11: JACK6.TIP_B@1(TIP) JACK6.TIP_T@3(TIP) R11.2
N$12: C9.1 IC4.2(K:-IN) R11.1 R13.2 R41.1
N$15: Q1.B R18.2
N$16: JACK4.TIP_B@1(TIP) JACK4.TIP_T@3(TIP) R18.1
N$33: JACK1.TIP_B@1(TIP) JACK1.TIP_T@3(TIP) R14.2
N$34: C16.1 IC4.6(L:-IN) R14.1 R22.2 R28.1
N$44: Q2.B R72.2
N$45: JACK5.TIP_B@1(TIP) JACK5.TIP_T@3(TIP) R72.1
REF_-5V [heavypower]: R3.2 R15.2 R28.2 R41.2 ; also sheet 3,4
RESET_PATTERN: Q1.C R20.1 ; also sheet 1
SYNC_LFO: Q2.C R73.1 ; also sheet 1
Unconnected: JACK1.SECOND_B@1(SECOND) JACK1.SECOND_T@3(SECOND) JACK2.SECOND_B@1(SECOND) JACK2.SECOND_T@3(SECOND) JACK3.SECOND_B@1(SECOND) JACK3.SECOND_T@3(SECOND) JACK4.SECOND_B@1(SECOND) JACK4.SECOND_T@3(SECOND) JACK5.SECOND_B@1(SECOND) JACK5.SECOND_T@3(SECOND) JACK6.SECOND_B@1(SECOND) JACK6.SECOND_T@3(SECOND)

### Notes on the sheet
- -5.0 to 5.0 -> 3.3 -> 0.0
- -5.0 to 5.0 -> 3.3 -> 0.0
- -5.0 to 5.0 -> 3.3 -> 0.0
- -5.0 to 5.0 -> 3.3 -> 0.0

## Library data of the parts
C1-C3 C9 C15 C16 = OPL:C*; OC_FARNELL: unknown
C4 C7 C10 C14 C17-C22 C24 C38 C40-C46 = resistor:C-EU: CAPACITOR, European symbol; MF: MULTICOMP; MPN: MC0603F104Z160CT; OC_FARNELL: 1759017
C5 C23 C48 = EurorackModularParts:C-POLAR*; MF: AVX; MPN: TAJB106K020RNJ; OC_FARNELL: 197427
C6 = resistor:C-EU: CAPACITOR, European symbol; MF: AVX; MPN: 06035C104KAT2A; OC_FARNELL: 1301804
C8 C11 C39 = OPL:C*
C25-C37 = Discrete:C*: Ceramic Capacitors
C74 C99 C100 = resistor:C-EU: CAPACITOR, European symbol
D1 D2 = OPL:D*: DIODE; MF: VISHAY; MPN: US1G-E3/5AT; OC_FARNELL: 9551824
D3-D14 D16 D17 D20-D22 D24-D35 D40 = EurorackModularParts:LED*: LED
D18 = OPL:D*: DIODE
IC2 = EurorackModularParts:TL072
IC3 = FarnellThings:MCP4822-E/SN: 12 Bit DAC; DESCRIPTION: 12 Bit DAC; MF: MICROCHIP; MPN: MCP4822-E/SN; OC_FARNELL: 1439414; OC_NEWARK: 31K2975; PACKAGE: SOIC-8; SUPPLIER: Microchip
IC4 = EurorackModularParts:MCP6004; MF: MICROCHIP; MPN: MCP6004-I/SL.; OC_FARNELL: 1605572
IC5-IC9 = FarnellThings:74HC595BQ: 8-bit serial-in, serial or parallel-out shift register,QFN-16; MF: NXP; MPN: 74HC595BQ; OC_FARNELL: 2164850; OC_NEWARK: 43W8000; PACKAGE: QFN-16; SUPPLIER: NXP
IC10 = 40xx:4052: Dual 4-channel ANALOG MULTIPLEXER
J1 = OPL:MICRO-USB-5P: ST-USB-001E：MICRO USB B SMD R/A
J14 = EurorackModularParts:POWER; OC_FARNELL: unknown
JACK1 = EurorackModularParts:AUDIO-JACK_SMALLSYMBOL: Switching Mono 3.5mm Audio Jack from Erthenvar.; DESC: Frequency
JACK2 = EurorackModularParts:AUDIO-JACK_SMALLSYMBOL: Switching Mono 3.5mm Audio Jack from Erthenvar.; DESC: Shape
JACK3 = EurorackModularParts:AUDIO-JACK_SMALLSYMBOL: Switching Mono 3.5mm Audio Jack from Erthenvar.; DESC: Mod
JACK4 = EurorackModularParts:AUDIO-JACK_SMALLSYMBOL: Switching Mono 3.5mm Audio Jack from Erthenvar.; DESC: Reset
JACK5 = EurorackModularParts:AUDIO-JACK_SMALLSYMBOL: Switching Mono 3.5mm Audio Jack from Erthenvar.; DESC: Sync
JACK6 = EurorackModularParts:AUDIO-JACK_SMALLSYMBOL: Switching Mono 3.5mm Audio Jack from Erthenvar.; DESC: Phase
JACK7 = EurorackModularParts:AUDIO-JACK_SMALLSYMBOL: Switching Mono 3.5mm Audio Jack from Erthenvar.; DESC: Normal Out
JACK8 = EurorackModularParts:AUDIO-JACK_SMALLSYMBOL: Switching Mono 3.5mm Audio Jack from Erthenvar.; DESC: Phased Out
JACK9 = EurorackModularParts:AUDIO-JACK_SMALLSYMBOL: Switching Mono 3.5mm Audio Jack from Erthenvar.; DESC: Normal Cycle
JACK10 = EurorackModularParts:AUDIO-JACK_SMALLSYMBOL: Switching Mono 3.5mm Audio Jack from Erthenvar.; DESC: Phased Cycle
K1 = OPL:BUTTON-4P
L1-L4 = OPL:L*
OUTLINE = EurorackModularParts:EURORACK_PCB; OC_FARNELL: unknown
Q1-Q3 Q5 = transistor:*-NPN-: NPN Transistror BF959 corrected 2008.03.06; MF: NXP; MPN: PMBT3904,215; OC_FARNELL: 2336795
Q4 = adafruit:XTAL-4: Classic 4-pin 3.2 x 2.5mm crystal
R1-R3 R5 R7-R16 R18-R32 R36 R37 R39-R41 R72 R73 = OPL:R*; OC_FARNELL: unknown
R4 R6 R33 R34 R52 R103 = Discrete:R*
R17 R42 R44 R45 R68 R69 = EurorackModularParts:POT; OC_FARNELL: unknown
R74 = OPL:R*
RN1-RN3 RN5-RN7 RN9 = resistor-dil:4R-N: Array Chip Resistor Source: RS Component / Phycomp; OC_FARNELL: unknown; OC_NEWARK: unknown
SWD2 = carrilib with jtags:CORTEX_SWD: .05" Cortex M Connector in SWD mode Manufacturer: Generic Part Number: Cortex M SWD Notes: I use Harwin M50-3600542 connectors; OC_FARNELL: unknown
TP1-TP4 TP6 TP7 = testpad:PTR1: TEST PIN
U1 = FarnellThings:LM4040DIM3-5.0: IC, Precision Micropower Shunt Voltage Reference, 5V,SOT-23-3; MF: TEXAS INSTRUMENTS; MPN: LM4040DIM3-5.0; OC_FARNELL: 9778330; OC_NEWARK: 97K3489; PACKAGE: SOT-23-3; SUPPLIER: TEXAS INSTRUMENTS
U$1 U$28 = zephod-components:SWITCH_W_LED_PB6149L-X-102
U$2 = RP2040:RP2040
U$5 = EurorackModularParts:BL9342
U$25 = RP2040:W25Q128JVSIQ

## Net classes
0 default: width 0.203 mm, clearance 0.178 mm
1 heavypower: width 0.305 mm
2 mediumpower: width 0.254 mm
3 groundplane: width 0.203 mm, clearance 0.203 mm
4 returnground: width 0.356 mm
5 reallyheav: width 0.762 mm